# EAGLE design pi-header (EAGLE 9.2.0)
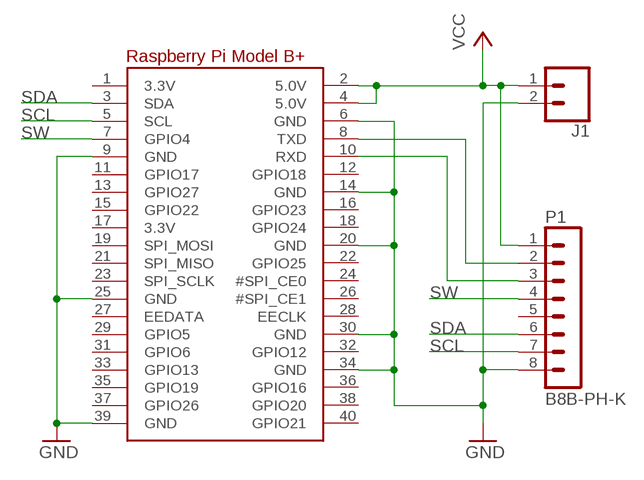
[diagram p0: schematic, sheet 1]

## Parts
J1  CONN_02PTH_RA_FEMALE  [1X02_RA_PTH_FEMALE]
P1  B8B-PH-K  [B8B-PH-K]
RPI1  MICROBUILDER_RASPBERRYPI_BPLUS_HATSLOTS  [MICROBUILDER_PI_HAT_SLOTS]

## Nets
GND [GND]: J1.2 P1.8 RPI1.6(GND) RPI1.9(GND) RPI1.14(GND) RPI1.20(GND) RPI1.25(GND) RPI1.30(GND) RPI1.34(GND) RPI1.39(GND)
N$1: P1.2 RPI1.8(TXD)
N$2: P1.3 RPI1.10(RXD)
SCL: P1.7 RPI1.5(SCL)
SDA: P1.6 RPI1.3(SDA)
SW: P1.4 RPI1.7(GPIO4)
VCC: J1.1 P1.1 RPI1.2(5.0V) RPI1.4(5.0V)
Unconnected: P1.5 RPI1.1(3.3V) RPI1.11(GPIO17) RPI1.12(GPIO18) RPI1.13(GPIO27) RPI1.15(GPIO22) RPI1.16(GPIO23) RPI1.17(3.3V) RPI1.18(GPIO24) RPI1.19(SPI_MOSI) RPI1.21(SPI_MISO) RPI1.22(GPIO25) RPI1.23(SPI_SCLK) RPI1.24(#SPI_CE0) RPI1.26(#SPI_CE1) RPI1.27(EEDATA) RPI1.28(EECLK) RPI1.29(GPIO5) RPI1.31(GPIO6) RPI1.32(GPIO12) RPI1.33(GPIO13) RPI1.35(GPIO19) RPI1.36(GPIO16) RPI1.37(GPIO26) RPI1.38(GPIO20) RPI1.40(GPIO21)

## Library data of the parts
J1 = SparkFun-Connectors:CONN_02: Multi connection point. Often used as Generic Header-pin footprint for 0.1 inch spaced/style header connections On any of the 0.1 inch spaced packages, you can populate with these: Break Away Headers - Straight <https://www.sparkfun.com/products/116> (PRT-00116) Break Away Male Headers - Right Angle <https://www.sparkfun.com/products/553> (PRT-00553) Female Headers <https://www.sparkfun.com/products/115> (PRT-00115) Break Away Headers - Machine Pin <https://www.sparkfun.com/products/117> (PRT-00117) Break Away Female Headers - Swiss Machine Pin <https://www.sparkfun.com/products/743> (PRT-00743) For SCREWTERMINALS and SPRING TERMINALS visit here: Screw Terimnals on SparkFun.com <https://www.sparkfun.com/search/results?term=Screw+Terminals> (5mm/3.5mm/2.54mm spacing) This device is also useful as a general connection point to wire up your design to another part of your project. Our various solder wires solder well into these plated through hole pads. Hook-Up Wire - Assortment (Stranded, 22 AWG) <https://www.sparkfun.com/products/11375> (PRT-11375) Hook-Up Wire - Assortment (Solid Core, 22 AWG) <https://www.sparkfun.com/products/11367> (PRT-11367) View the entire wire category on our website here <https://www.sparkfun.com/categories/141> Special notes: Molex polarized connector foot print use with: PRT-08233 with associated crimp pins and housings. 2.54_SCREWTERM for use with PRT-10571. 3.5mm Screw Terminal footprints for PRT-08084 5mm Screw Terminal footprints for use with PRT-08432; PROD_ID: CONN-13700
P1 = con-jst-ph:B8B-PH-K: HEADER
RPI1 = Adafruit HaD Proto HAT rev A:MICROBUILDER_RASPBERRYPI_BPLUS

## Net classes
0 default: width 0.406 mm, clearance 0.203 mm
1 GND: clearance 0.254 mm
2 VCC: clearance 0.254 mm

## Board
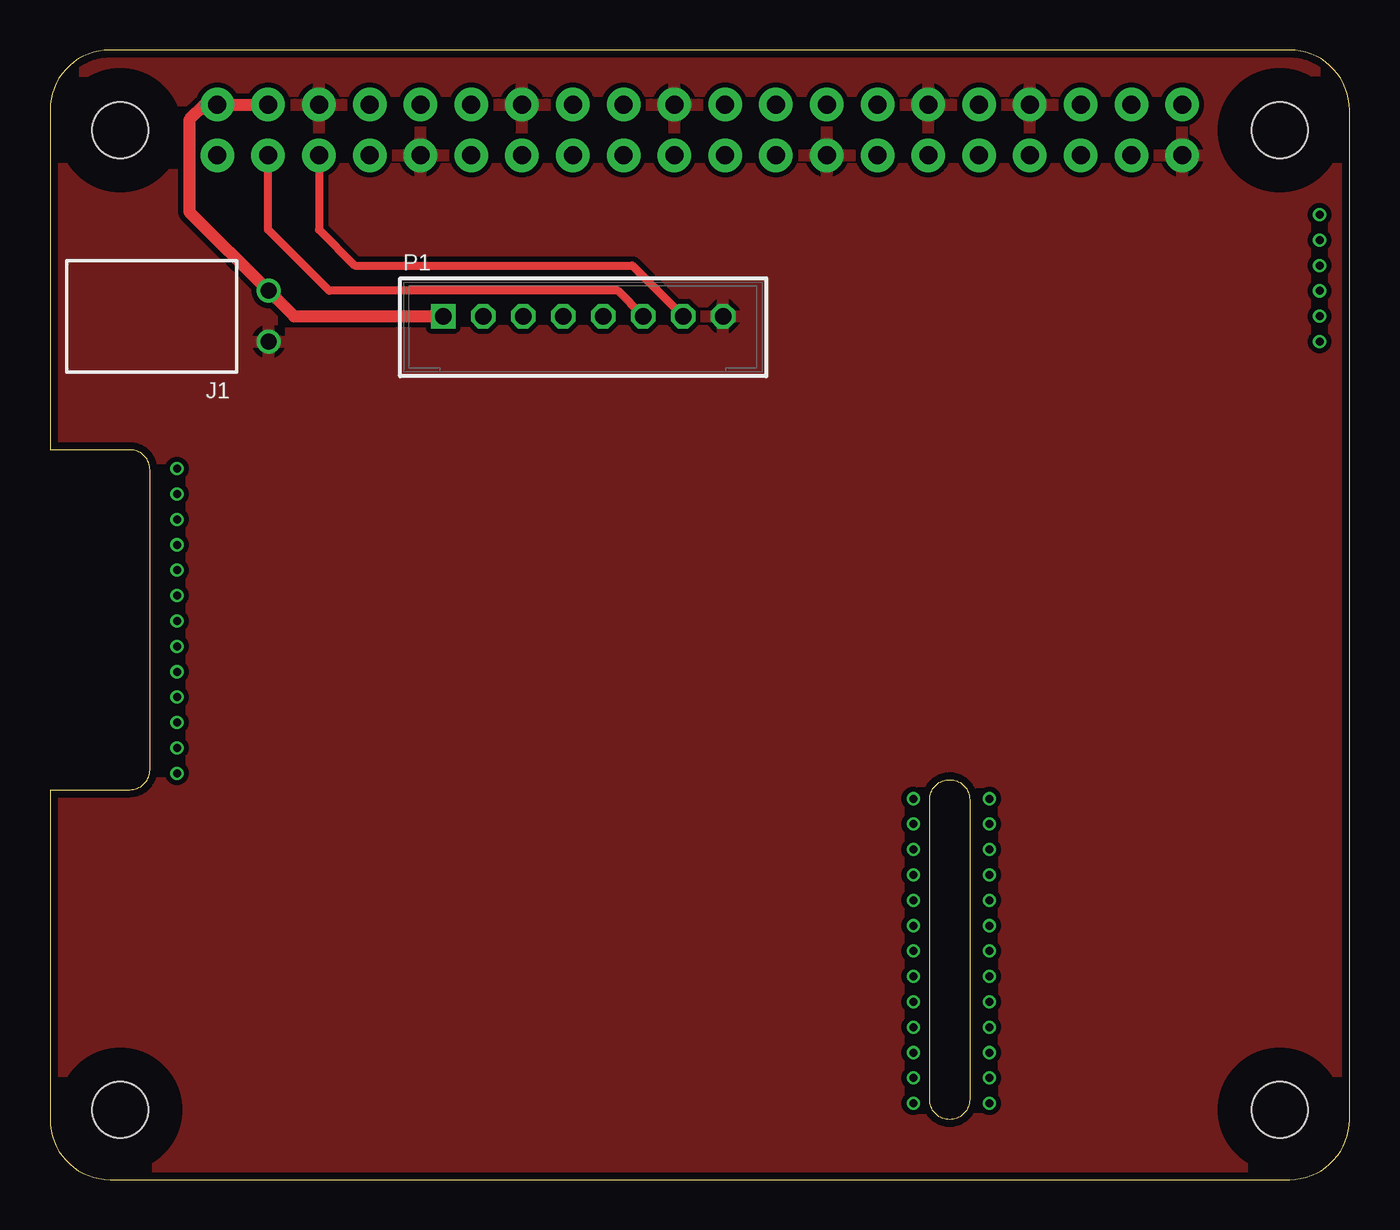
[diagram p1: board, top side]
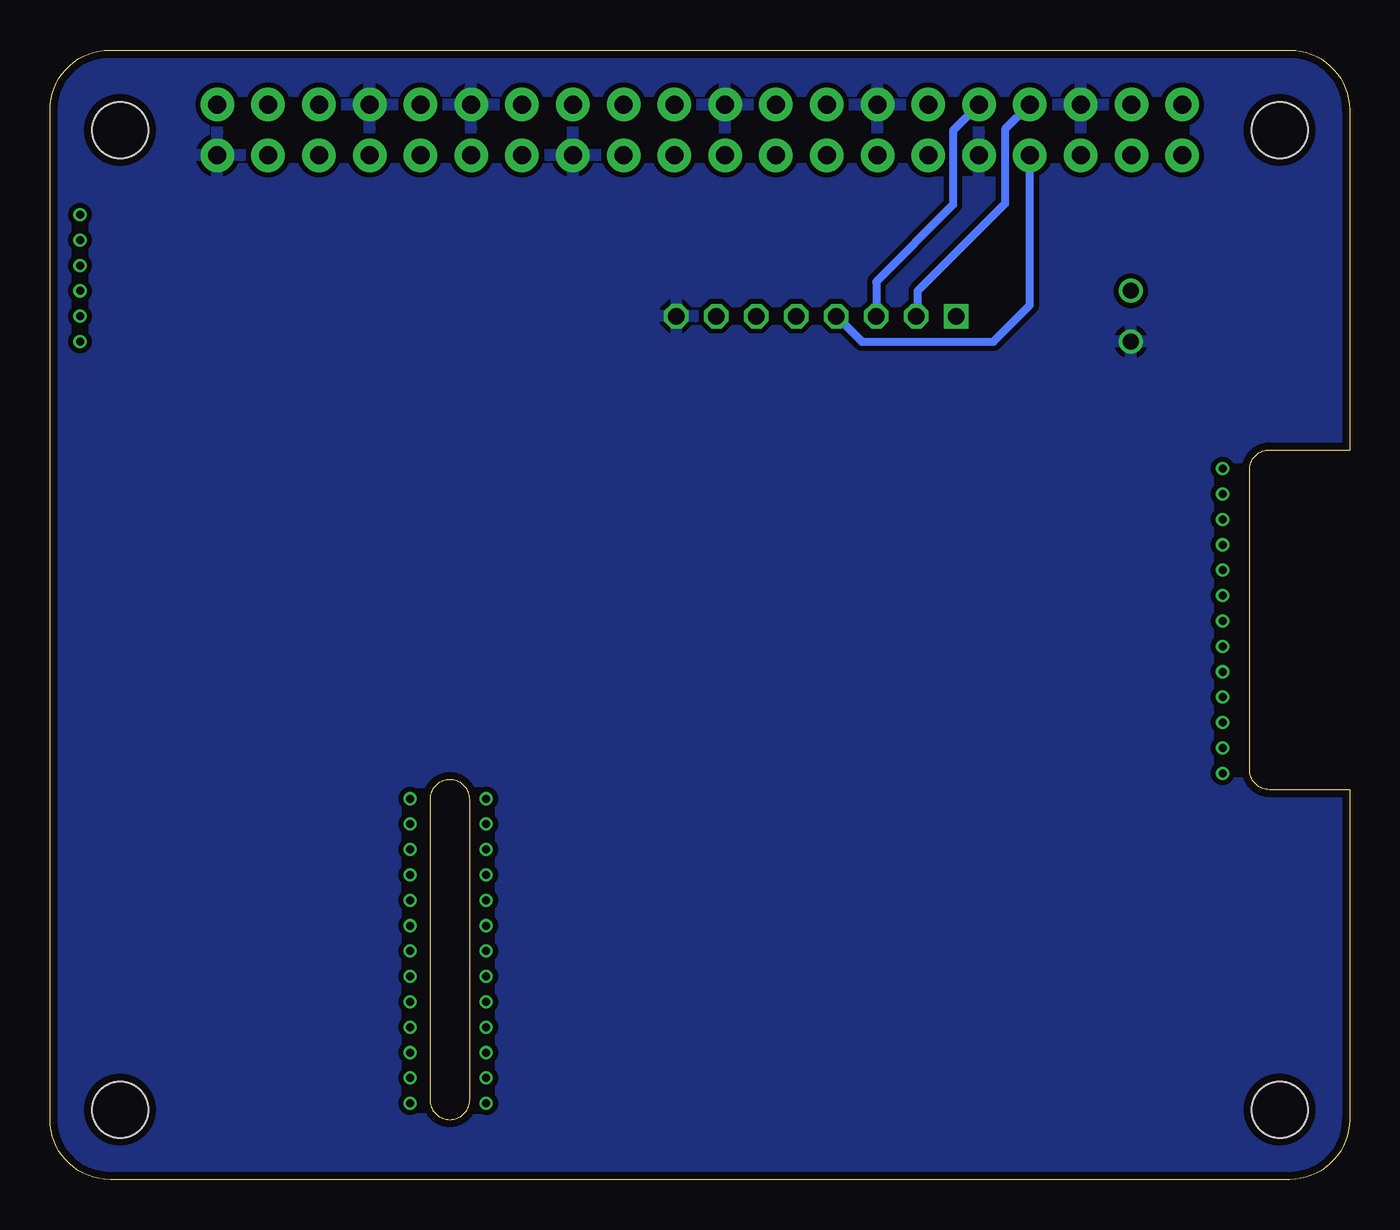
[diagram p2: board, bottom side, seen from below]

Size 65 x 56.5 mm. Coordinates in mm from the lower left corner, seen from the top.
Copper layers (1*16): Top 0.035559375mm / dielectric 1.6mm / Bottom 0.035559375mm
Design rules "oshpark-2layer": minimum track width 6mil, minimum drill 10mil, track to track 6mil, track to pad 6mil, pad to pad 6mil, via to via 6mil, smd to smd 6mil, copper to edge 15mil, drill to drill 6mil, minimum pad ring 5mil, minimum via ring 5mil, stop-mask expansion 2.5mil, vias tented up to drill 0mil, thermal gap 10mil

### Footprints (pad centres in the part's own frame; a part is rotated, then mirrored left to right if it is on the bottom)
1X02_RA_PTH_FEMALE = drill 0.8: 1 1.27,-5.85; 2 -1.27,-5.85
B8B-PH-K = drill 0.813 square: 1 -7,0 | drill 0.813 octagon: 2 -5,0; 3 -3,0; 4 -1,0; 5 1,0; 6 3,0; 7 5,0; 8 7,0
MICROBUILDER_PI_HAT_SLOTS = drill 0.9 pad 1.676: 1 8.37,51.23; 2 8.37,53.77; 3 10.91,51.23; 4 10.91,53.77; 5 13.45,51.23; 6 13.45,53.77; 7 15.99,51.23; 8 15.99,53.77; 9 18.53,51.23; 10 18.53,53.77; 11 21.07,51.23; 12 21.07,53.77; 13 23.61,51.23; 14 23.61,53.77; 15 26.15,51.23; 16 26.15,53.77; 17 28.69,51.23; 18 28.69,53.77; 19 31.23,51.23; 20 31.23,53.77; 21 33.77,51.23; 22 33.77,53.77; 23 36.31,51.23; 24 36.31,53.77; 25 38.85,51.23; 26 38.85,53.77; 27 41.39,51.23; 28 41.39,53.77; 29 43.93,51.23; 30 43.93,53.77; 31 46.47,51.23; 32 46.47,53.77; 33 49.01,51.23; 34 49.01,53.77; 35 51.55,51.23; 36 51.55,53.77; 37 54.09,51.23; 38 54.09,53.77; 39 56.63,51.23; 40 56.63,53.77 | hole 2.8: 3.5,3.5; 3.5,52.5; 61.5,52.5; 61.5,3.5

### Placement (x,y rotation side)
J1  5.08,43.18 90 top
P1  26.67,43.18 0 top
RPI1  0,0 0 top

### Tracks (layer width: path | path; a pad name or v marks a point on that pad's centre or on a via)
GND
  pour Top: 0,57.15 64.77,57.15 64.77,0 0,0 0,55.88
  pour Bottom: 0,57.15 64.77,57.15 64.77,0 0,0
N$1
  Bottom 0.406: P1.2 21.59,43.26 21.59,44.45 17.23,48.8 17.23,52.52 RPI1.8
N$2
  Bottom 0.406: P1.3 23.67,44.91 19.82,48.76 19.82,52.48 RPI1.10
N$3  (via drill 0.4)
  other vias: 43.18,19.05
N$4  (via drill 0.4)
  other vias: 43.18,17.78
N$5  (via drill 0.4)
  other vias: 43.18,16.51
N$6  (via drill 0.4)
  other vias: 43.18,15.24
N$7  (via drill 0.4)
  other vias: 43.18,13.97
N$8  (via drill 0.4)
  other vias: 43.18,12.7
N$9  (via drill 0.4)
  other vias: 43.18,11.43
N$10  (via drill 0.4)
  other vias: 43.18,10.16
N$11  (via drill 0.4)
  other vias: 43.18,7.62
N$12  (via drill 0.4)
  other vias: 43.18,8.89
N$13  (via drill 0.4)
  other vias: 43.18,6.35
N$14  (via drill 0.4)
  other vias: 43.18,5.08
N$15  (via drill 0.4)
  other vias: 43.18,3.81
N$16  (via drill 0.4)
  other vias: 46.99,3.81
N$17  (via drill 0.4)
  other vias: 46.99,5.08
N$18  (via drill 0.4)
  other vias: 46.99,6.35
N$19  (via drill 0.4)
  other vias: 46.99,7.62
N$20  (via drill 0.4)
  other vias: 46.99,8.89
N$21  (via drill 0.4)
  other vias: 46.99,10.16
N$22  (via drill 0.4)
  other vias: 46.99,11.43
N$23  (via drill 0.4)
  other vias: 46.99,12.7
N$24  (via drill 0.4)
  other vias: 46.99,13.97
N$25  (via drill 0.4)
  other vias: 46.99,15.24
N$26  (via drill 0.4)
  other vias: 46.99,16.51
N$27  (via drill 0.4)
  other vias: 46.99,17.78
N$28  (via drill 0.4)
  other vias: 46.99,19.05
N$29  (via drill 0.4)
  other vias: 6.35,34.29
N$30  (via drill 0.4)
  other vias: 6.35,33.02
N$31  (via drill 0.4)
  other vias: 6.35,31.75
N$32  (via drill 0.4)
  other vias: 6.35,30.48
N$33  (via drill 0.4)
  other vias: 6.35,29.21
N$34  (via drill 0.4)
  other vias: 6.35,27.94
N$35  (via drill 0.4)
  other vias: 6.35,26.67
N$36  (via drill 0.4)
  other vias: 6.35,25.4
N$37  (via drill 0.4)
  other vias: 6.35,24.13
N$38  (via drill 0.4)
  other vias: 6.35,22.86
N$39  (via drill 0.4)
  other vias: 6.35,21.59
N$40  (via drill 0.4)
  other vias: 6.35,35.56
N$41  (via drill 0.4)
  other vias: 6.35,20.32
N$46  (via drill 0.4)
  other vias: 63.5,48.26
N$47  (via drill 0.4)
  other vias: 63.5,46.99
N$48  (via drill 0.4)
  other vias: 63.5,45.72
N$49  (via drill 0.4)
  other vias: 63.5,44.45
N$50  (via drill 0.4)
  other vias: 63.5,43.18
N$51  (via drill 0.4)
  other vias: 63.5,41.91
SCL
  Top 0.406: RPI1.5 13.45,47.51 15.24,45.72 29.13,45.72 P1.7
SDA
  Top 0.406: P1.6 28.4,44.45 13.97,44.45 10.91,47.51 RPI1.3
SW
  Bottom 0.406: P1.4 24.4,41.91 17.81,41.91 15.99,43.73 RPI1.7
VCC
  Top 0.61: RPI1.4 RPI1.2 7.74,53.77 6.97,53.01 6.97,48.41 J1.1 12.2,43.18 P1.1